# EAGLE design power_pre (EAGLE 6.5.0)
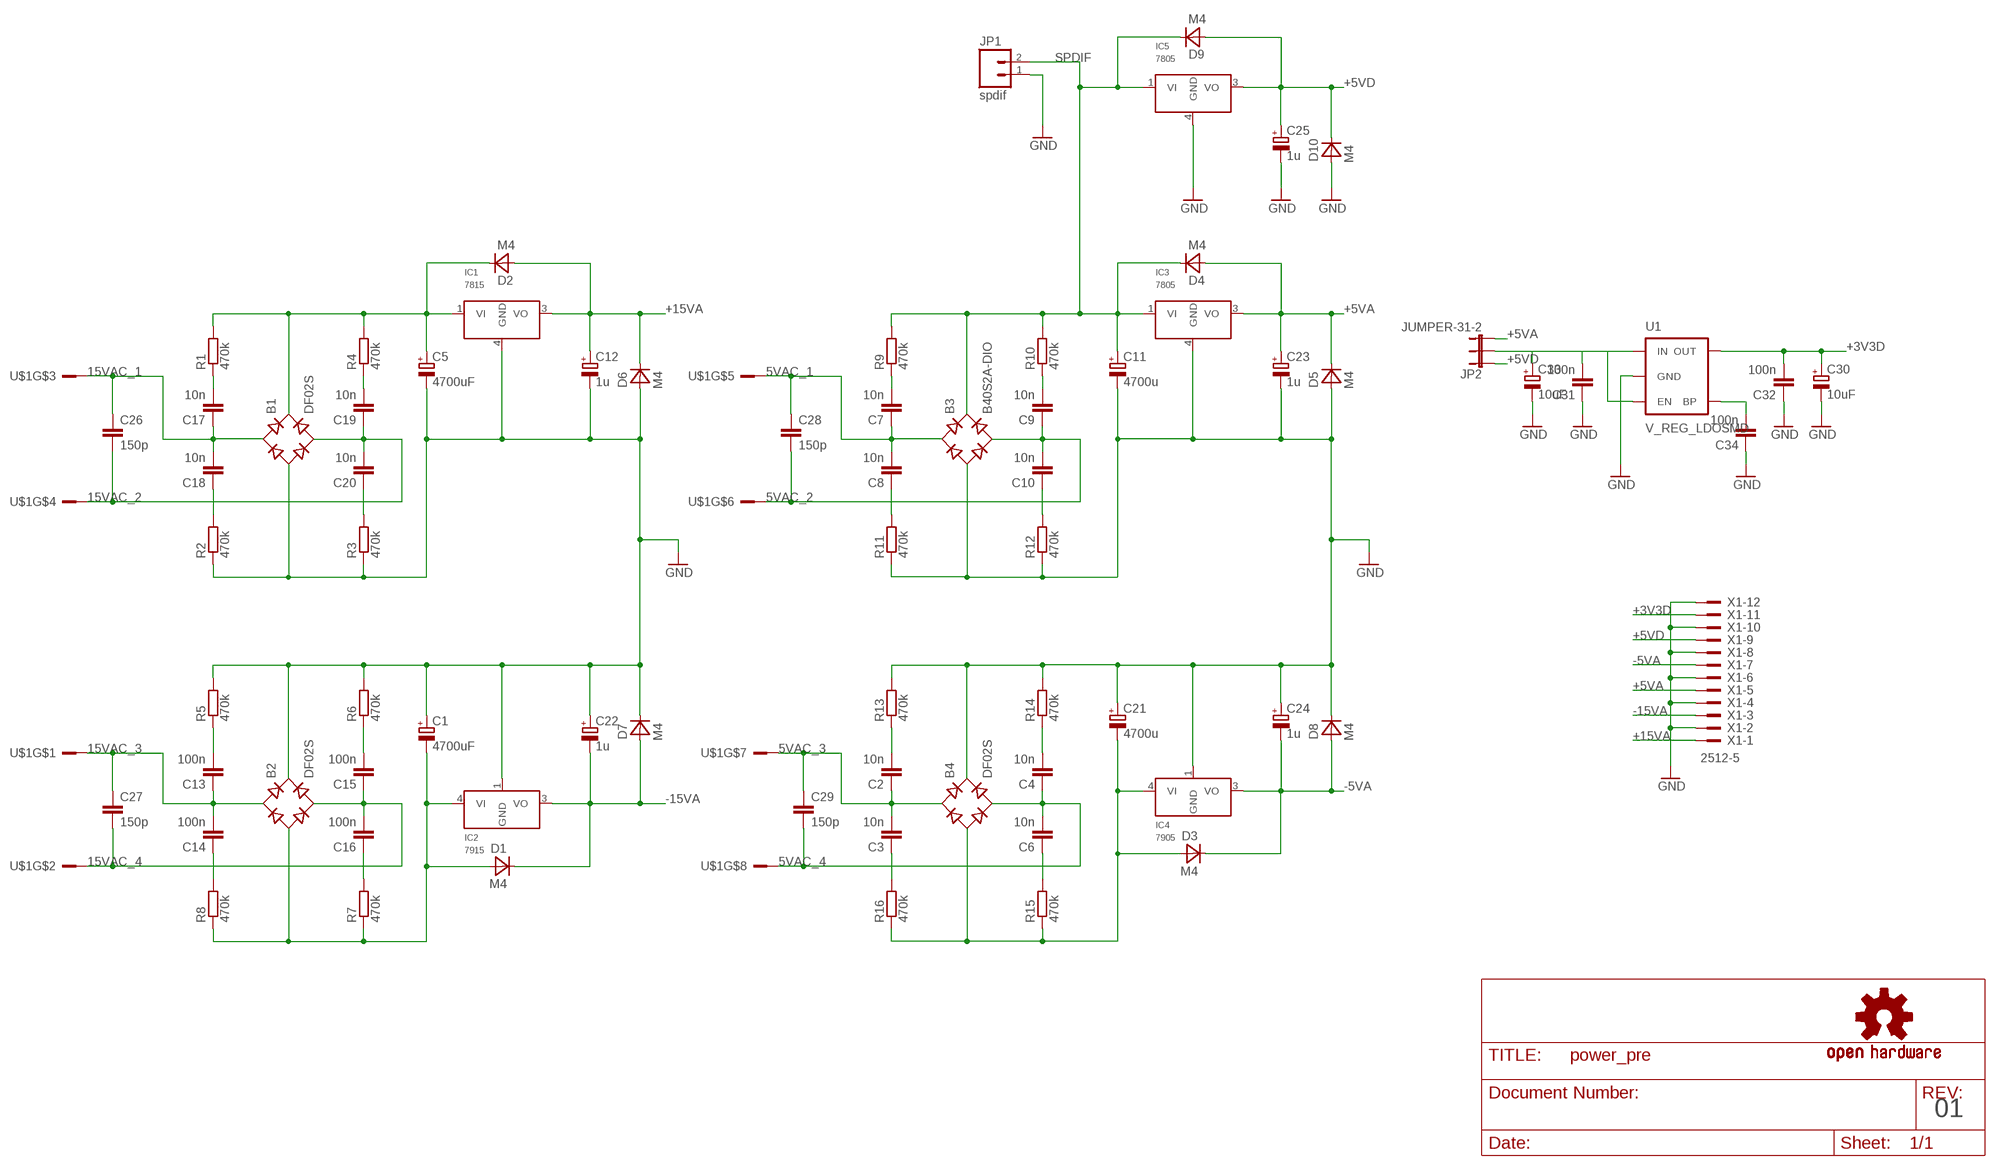
[diagram p0: schematic, sheet 1]

## Parts
B1  DF02S  [DFS]
B2  DF02S  [DFS]
B3  B40S2A-DIO  DF02S  [DFS]
B4  DF02S  [DFS]
C1  4700uF  CPOL-EUE7.5-18  [E7,5-18]
C2  10n  C-EUC0805  [C0805]
C3  10n  C-EUC0805  [C0805]
C4  10n  C-EUC0805  [C0805]
C5  4700uF  CPOL-EUE7.5-18  [E7,5-18]
C6  10n  C-EUC0805  [C0805]
C7  10n  C-EUC0805  [C0805]
C8  10n  C-EUC0805  [C0805]
C9  10n  C-EUC0805  [C0805]
C10  10n  C-EUC0805  [C0805]
C11  4700u  CPOL-EUE7.5-16  [E7,5-16]
C12  1u  CPOL-EUB  [PANASONIC_B]
C13  100n  C-EUC0805  [C0805]
C14  100n  C-EUC0805  [C0805]
C15  100n  C-EUC0805  [C0805]
C16  100n  C-EUC0805  [C0805]
C17  10n  C-EUC0805  [C0805]
C18  10n  C-EUC0805  [C0805]
C19  10n  C-EUC0805  [C0805]
C20  10n  C-EUC0805  [C0805]
C21  4700u  CPOL-EUE7.5-16  [E7,5-16]
C22  1u  CPOL-EUB  [PANASONIC_B]
C23  1u  CPOL-EUB  [PANASONIC_B]
C24  1u  CPOL-EUB  [PANASONIC_B]
C25  1u  CPOL-EUB  [PANASONIC_B]
C26  150p  C5/4.5  [C5B4.5]
C27  150p  C5/4.5  [C5B4.5]
C28  150p  C5/4.5  [C5B4.5]
C29  150p  C5/4.5  [C5B4.5]
C30  10uF  CPOL-EU153CLV-0405  [153CLV-0405]
C31  100n  C-EUC0805  [C0805]
C32  100n  C-EUC0805  [C0805]
C33  10uF  CPOL-EU153CLV-0405  [153CLV-0405]
C34  100n  C-EUC0805  [C0805]
D1  M4  MBRA340T3  [SMA]
D2  M4  MBRA340T3  [SMA]
D3  M4  MBRA340T3  [SMA]
D4  M4  MBRA340T3  [SMA]
D5  M4  MBRA340T3  [SMA]
D6  M4  MBRA340T3  [SMA]
D7  M4  MBRA340T3  [SMA]
D8  M4  MBRA340T3  [SMA]
D9  M4  MBRA340T3  [SMA]
D10  M4  MBRA340T3  [SMA]
IC1  7815  78XX  [D2PACK]
IC2  7915  79XX  [D2PACK]
IC3  7805  78XX  [D2PACK]
IC4  7905  79XX  [D2PACK]
IC5  7805  78XX  [D2PACK]
JP1  spdif  M02PTH  [1X02]
JP2  JUMPER-31-2  [SJ_3_PASTE1&2]
R1  470k  R-EU_R0805W  [R0805W]
R2  470k  R-EU_R0805W  [R0805W]
R3  470k  R-EU_R0805W  [R0805W]
R4  470k  R-EU_R0805W  [R0805W]
R5  470k  R-EU_R0805W  [R0805W]
R6  470k  R-EU_R0805W  [R0805W]
R7  470k  R-EU_R0805W  [R0805W]
R8  470k  R-EU_R0805W  [R0805W]
R9  470k  R-EU_R0805W  [R0805W]
R10  470k  R-EU_R0805W  [R0805W]
R11  470k  R-EU_R0805W  [R0805W]
R12  470k  R-EU_R0805W  [R0805W]
R13  470k  R-EU_R0805W  [R0805W]
R14  470k  R-EU_R0805W  [R0805W]
R15  470k  R-EU_R0805W  [R0805W]
R16  470k  R-EU_R0805W  [R0805W]
U1  V_REG_LDOSMD  [SOT23-5]
U$1  DEGSON_8  [DEGSON_8]
U$7  OSHW-LOGOM  [OSHW-LOGO-M]
X1  2512-5  [PAK100/2500-5-12]

## Nets
5VAC_1: B3.AC1 C7.1 C8.2 C28.1 U$1.5
5VAC_2: B3.AC2 C9.1 C10.2 C28.2 U$1.6
5VAC_3: B4.AC1 C2.1 C3.2 C29.1 U$1.7
5VAC_4: B4.AC2 C4.1 C6.2 C29.2 U$1.8
15VAC_1: B1.AC1 C17.1 C18.2 C26.1 U$1.3
15VAC_2: B1.AC2 C19.1 C20.2 C26.2 U$1.4
15VAC_3: B2.AC1 C13.1 C14.2 C27.1 U$1.1
15VAC_4: B2.AC2 C15.1 C16.2 C27.2 U$1.2
+3V3D: C30.+ C32.2 U1.5(OUT) X1.11
+5VA: C23.+ D4.A D5.C IC3.3(VO) JP2.3 X1.5
+5VD: C25.+ D9.A D10.C IC5.3(VO) JP2.1 X1.9
+15VA: C12.+ D2.A D6.C IC1.3(VO) X1.1
-5VA: C24.- D3.C D8.A IC4.3(VO) X1.7
-15VA: C22.- D1.C D7.A IC2.3(VO) X1.3
GND: B1.- B2.+ B3.- B4.+ C1.+ C5.- C11.- C12.- C21.+ C22.+ C23.- C24.+ C25.- C30.- C31.1 C32.1 C33.- C34.1 D5.A D6.A D7.C D8.C D10.A IC1.4(GND) IC2.1(GND) IC3.4(GND) IC4.1(GND) IC5.4(GND) JP1.1 R2.1 R3.1 R5.2 R6.2 R11.1 R12.1 R13.2 R14.2 U1.2(GND) X1.2 X1.4 X1.6 X1.8 X1.10 X1.12
N$1: C7.2 R9.1
N$2: C18.1 R2.2
N$4: C31.2 C33.+ JP2.2 U1.1(IN) U1.3(EN)
N$6: C13.2 R5.1
N$7: C34.2 U1.4(BP)
N$8: B1.+ C5.+ D2.C IC1.1(VI) R1.2 R4.2
N$9: C17.2 R1.1
N$10: B4.- C21.- D3.A IC4.4(VI) R15.1 R16.1
N$11: C19.2 R4.1
N$12: C20.1 R3.2
N$14: C6.1 R15.2
N$15: C8.1 R11.2
N$16: B2.- C1.- D1.A IC2.4(VI) R7.1 R8.1
N$17: C14.1 R8.2
N$18: C16.1 R7.2
N$19: C15.2 R6.1
N$20: C10.1 R12.2
N$21: C9.2 R10.1
N$23: C3.1 R16.2
N$24: C2.2 R13.1
N$25: C4.2 R14.1
SPDIF: B3.+ C11.+ D4.C D9.C IC3.1(VI) IC5.1(VI) JP1.2 R9.2 R10.2

## Notes on the sheet
- 01

## Library data of the parts
B1-B4 = rectifier:DF*S: Surface Mount Glass Passivated Bridge Rectifiers Source: Source: Comchip Bridge Rectifiers DF005S-G thru DF10S-G.pdf
C1 C5 C11 C12 C21-C25 C30 C33 = rcl:CPOL-EU: POLARIZED CAPACITOR, European symbol
C2-C4 C6-C10 C13-C20 C31 C32 C34 = rcl:C-EU: CAPACITOR, European symbol
C26-C29 = capacitor-wima:C: CAPACITOR naming: grid - package width
D1-D10 = diode:MBRA340T3: Surface Mount Schottky Power Rectifier Source: http://www.onsemi.com/pub_link/Collateral/MBRA340T3-D.PDF
IC1 IC3 IC5 = Simplex-ICs:78XX: 78xx positive voltage linear regulators
IC2 IC4 = Simplex-ICs:79XX: 79xx negative voltage linear regulators
JP1 = SparkFun-Connectors:M02: Standard 2-pin 0.1" header. Use with - straight break away headers ( PRT-00116) - right angle break away headers (PRT-00553) - swiss pins (PRT-00743) - machine pins (PRT-00117) - female headers (PRT-00115) Molex polarized connector foot print use with: PRT-08233 with associated crimp pins and housings. 2.54_SCREWTERM for use with PRT-10571. 3.5mm Screw Terminal footprints for PRT-08084 5mm Screw Terminal footprints for use with PRT-08433
JP2 = SparkFun-Passives:JUMPER-3
R1-R16 = rcl:R-EU_: RESISTOR, European symbol
U1 = SparkFun-PowerIC:V_REG_LDO: Voltage Regulator LDO Standard 150mA LDO voltage regulator in SOT-23 layout. Micrel part MIC5205. BP (by-pass) pin is used to lower output noise with 470pF cap.
U$1 = Simplex-Connectors:DEGSON_8: DG58C-B-08P-13 Degson Electronics 8 pole screw terminal 10mm grid
U$7 = SparkFun:OSHW-LOGO: Open Source Hardware Logo This logo indicates the piece of hardware it is found on incorporates a OSHW license and/or adheres to the definition of open source hardware found here: http://freedomdefined.org/OSHW
X1 = Simplex-Connectors:2512-: 3M (TM) Pak 100 4-Wall Header Source: 3M; MPN: N2514-5002RB; OC_FARNELL: 1788673; OC_NEWARK: 97K6709

## Net classes
1 vcc: width 0.203 mm

## Board
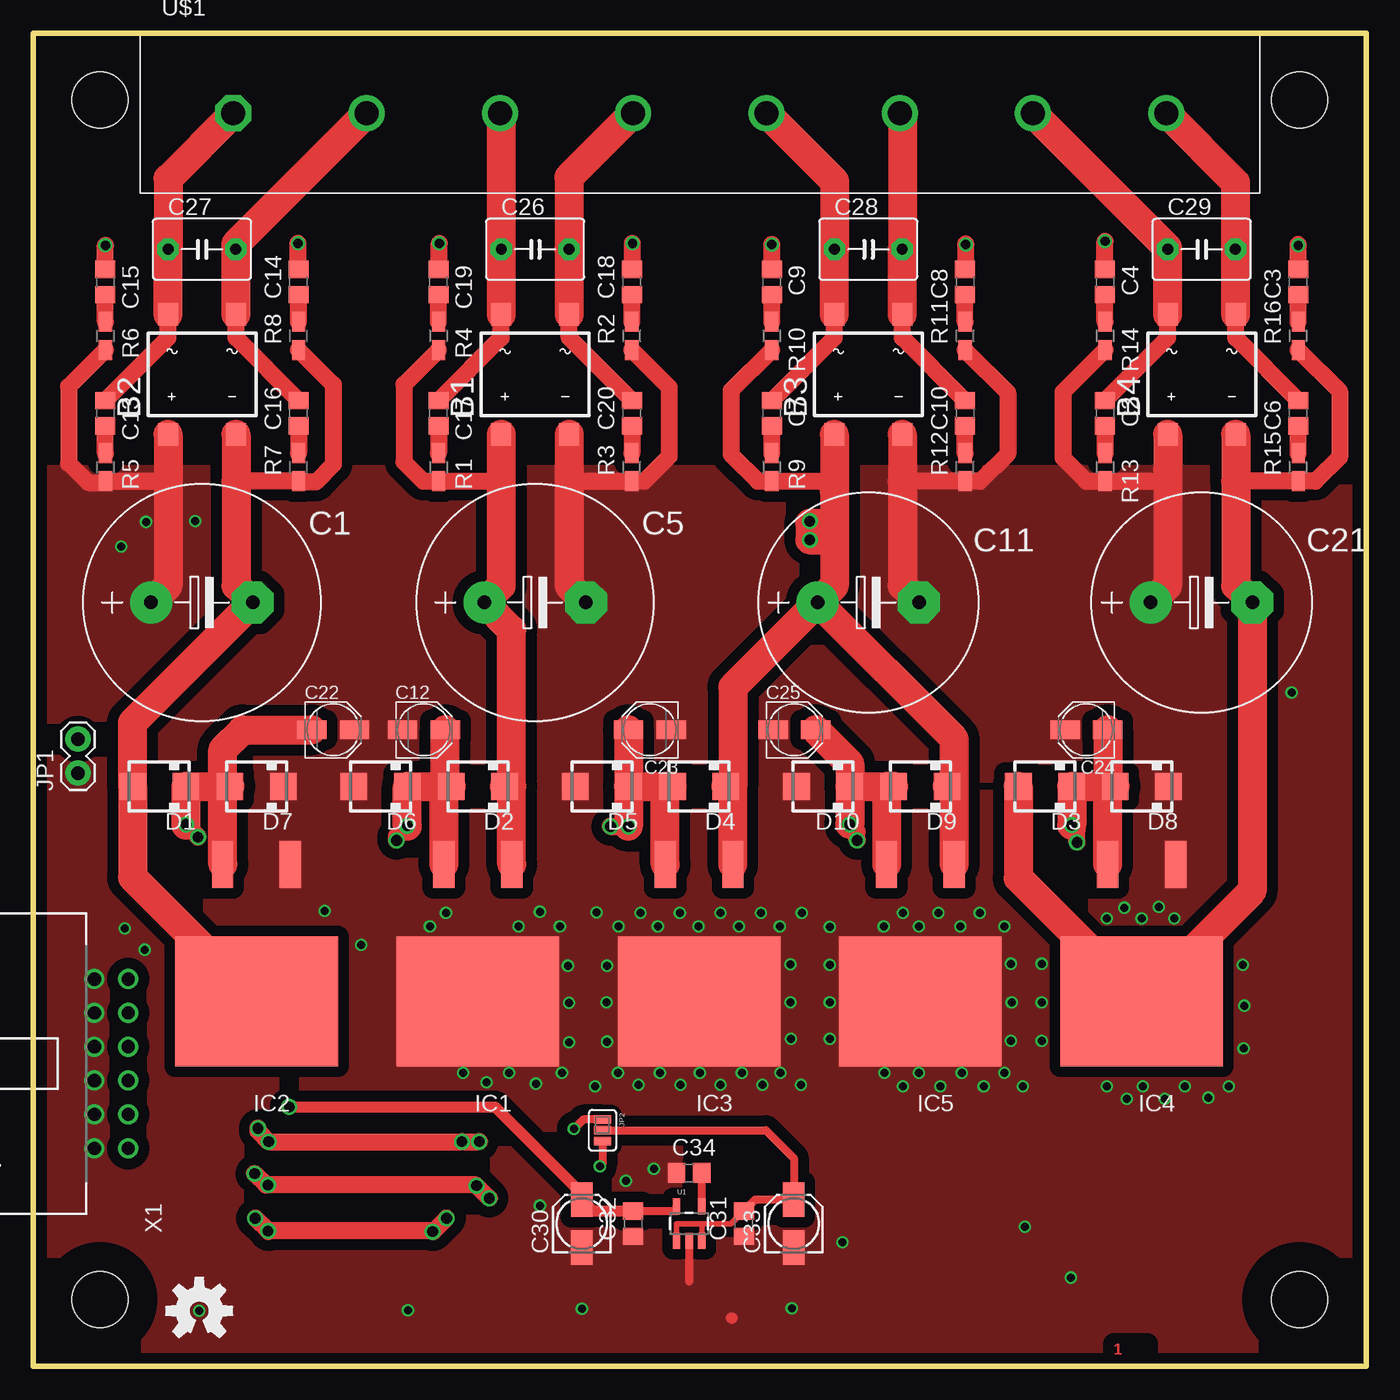
[diagram p1: board, top side]
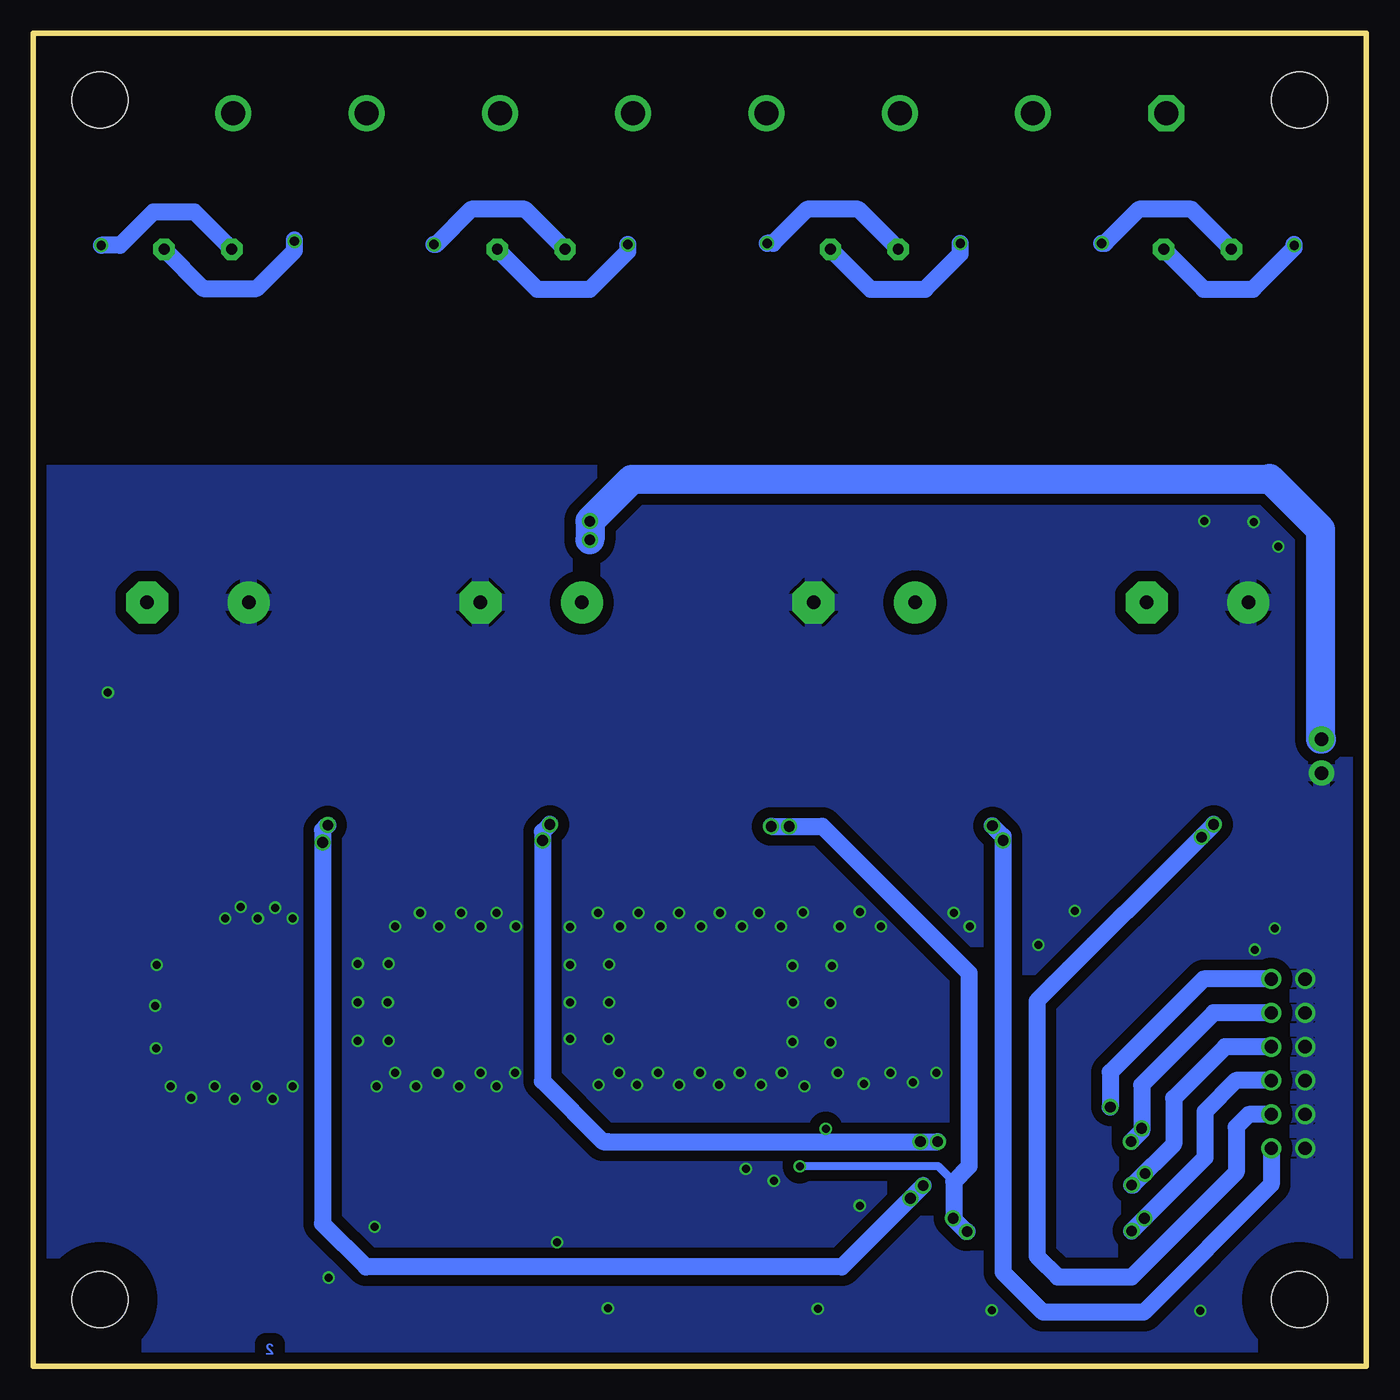
[diagram p2: board, bottom side, seen from below]

Size 100 x 100 mm. Coordinates in mm from the lower left corner, seen from the top.
Outline: 0,0 100,0 100,100 0,100 0,0
Copper layers (1*2*15*16): Top 0.035mm / dielectric 0.2mm / Route2 0.0175mm / dielectric 1.1mm / Route15 0.0175mm / dielectric 0.2mm / Bottom 0.035mm
Design rules "SeeedStudio_DRU_no_angle_20130527": minimum track width 6mil, minimum drill 12mil, track to track 6mil, track to pad 6mil, pad to pad 6mil, via to via 6mil, smd to smd 0mil, copper to edge 10mil, drill to drill 10mil, minimum pad ring 6mil, minimum via ring 6mil, stop-mask expansion 2mil, vias tented up to drill 25mil, thermal gap 10mil
Holes 4.2 mm at 5,95 95,5 5,5 95,95
tRestrict: area 91.7,1.7 to 98.3,8.3; area 91.7,91.7 to 98.3,98.3; area 1.7,1.7 to 8.3,8.3; area 1.7,91.7 to 8.3,98.3
bRestrict: area 1.7,91.7 to 8.3,98.3; area 91.7,91.7 to 98.3,98.3; area 91.7,1.7 to 98.3,8.3; area 1.7,1.7 to 8.3,8.3

### Footprints (pad centres in the part's own frame; a part is rotated, then mirrored left to right if it is on the bottom)
DFS = smd 1.5 x 1.7: + -2.55,-4.5; - 2.55,-4.5; AC1 -2.55,4.5; AC2 2.55,4.5
E7,5-18 = drill 1.016 pad 3.15: + -3.81,0 | drill 1.016 pad 3.15 octagon: - 3.81,0
C0805 = smd 1.3 x 1.5: 1 -0.95,0; 2 0.95,0
E7,5-16 = drill 1.016 pad 3.15: + -3.81,0 | drill 1.016 pad 3.15 octagon: - 3.81,0
PANASONIC_B = smd 2.2 x 1.4: + 1.6,0; - -1.6,0
C5B4.5 = drill 0.813 pad 1.6 octagon: 1 -2.54,0; 2 2.54,0
153CLV-0405 = smd 2.6 x 1.6: + 1.8,0; - -1.8,0
SMA = smd 2 x 2: A 2,0; C -2,0
D2PACK = smd 1.6 x 3.5: 1 -2.54,1.75; 3 2.54,1.75 | smd 12.2 x 9.75: 4 0,12.025
1X02 = drill 1.016 pad 1.88: 1 0,0; 2 2.54,0
SJ_3_PASTE1&2 = smd 0.635 x 1.27: 1 -0.813,0; 2 0,0; 3 0.813,0
R0805W = smd 1.5 x 1: 1 -1.052,0; 2 1.052,0
SOT23-5 = smd 0.55 x 1.2: 1 -0.95,-1.3; 2 0,-1.3; 3 0.95,-1.3; 4 0.95,1.3; 5 -0.95,1.3
DEGSON_8 = drill 1.8 octagon: 1 -35,0 | drill 1.8: 2 -25,0; 3 -15,0; 4 -5,0; 5 5,0; 6 15,0; 7 25,0; 8 35,0
PAK100/2500-5-12 = drill 1 pad 1.422: 1 -6.35,-1.27; 2 -6.35,1.27; 3 -3.81,-1.27; 4 -3.81,1.27; 5 -1.27,-1.27; 6 -1.27,1.27; 7 1.27,-1.27; 8 1.27,1.27; 9 3.81,-1.27; 10 3.81,1.27; 11 6.35,-1.27; 12 6.35,1.27

### Placement (x,y rotation side)
B1  37.65,74.4 0 top
B2  12.65,74.4 0 top
B3  62.65,74.4 0 top
B4  87.65,74.4 0 top
C1  12.65,57.3 0 top
C2  80.4,71.5 270 top
C3  94.9,81.35 90 top
C4  80.4,81.35 270 top
C5  37.65,57.3 0 top
C6  94.9,71.5 90 top
C7  55.4,71.5 270 top
C8  69.9,81.35 90 top
C9  55.4,81.35 270 top
C10  69.9,71.5 90 top
C11  62.65,57.3 0 top
C12  29.3,47.75 0 top
C13  5.4,71.5 270 top
C14  19.9,81.35 90 top
C15  5.4,81.35 270 top
C16  19.9,71.5 90 top
C17  30.4,71.5 270 top
C18  44.9,81.35 90 top
C19  30.4,81.35 270 top
C20  44.9,71.5 90 top
C21  87.65,57.3 0 top
C22  22.5,47.75 0 top
C23  46.25,47.75 180 top
C24  79,47.75 180 top
C25  57.1,47.75 0 top
C26  37.65,83.8 0 top
C27  12.65,83.8 0 top
C28  62.65,83.8 0 top
C29  87.65,83.8 0 top
C30  41.15,10.7 90 top
C31  53.3,10.7 90 top
C32  45,10.7 90 top
C33  57.05,10.7 90 top
C34  49.2,14.5 0 top
D1  9.45,43.5 180 top
D2  33.35,43.5 180 top
D3  75.9,43.5 180 top
D4  49.95,43.5 180 top
D5  42.65,43.5 180 top
D6  26.05,43.5 180 top
D7  16.75,43.5 180 top
D8  83.15,43.5 180 top
D9  66.55,43.5 180 top
D10  59.25,43.5 180 top
IC1  33.35,39.4 180 top
IC2  16.75,39.4 180 top
IC3  49.95,39.4 180 top
IC4  83.15,39.4 180 top
IC5  66.55,39.4 180 top
JP1  3.35,44.5 90 top
JP2  42.7,17.7 270 top
R1  30.4,67.45 270 top
R2  44.9,77.3 90 top
R3  44.9,67.45 90 top
R4  30.4,77.3 270 top
R5  5.4,67.45 270 top
R6  5.4,77.3 270 top
R7  19.9,67.45 90 top
R8  19.9,77.3 90 top
R9  55.4,67.45 270 top
R10  55.4,77.3 270 top
R11  69.9,77.3 90 top
R12  69.9,67.45 90 top
R13  80.4,67.45 270 top
R14  80.4,77.3 270 top
R15  94.9,67.45 90 top
R16  94.9,77.3 90 top
U1  49.2,10.7 0 top
U$1  50,94 0 top
U$7  12.45,4.15 0 top
X1  5.85,22.7 90 top

### Tracks (layer width: path | path; a pad name or v marks a point on that pad's centre or on a via)
5VAC_1  (via drill 0.7)
  Top 1.27: C7.1 60.1,77.15 B3.AC1 | C8.2 69.95,82.35 v69.95,84.15 69.95,84.2
  Top 2.184: B3.AC1 C28.1 60.11,88.89 U$1.5
  Bottom 1.27: C28.1 63.11,86.8 67.15,86.8 69.8,84.15 v69.95,84.15
5VAC_2  (via drill 0.7)
  Top 1.27: C10.2 65.2,77.15 B3.AC2 | C9.1 v55.4,84.15
  Top 2.184: B3.AC2 C28.2 65.19,93.81 U$1.6
  Bottom 1.27: C28.2 62.19,80.8 58.25,80.8 55.4,83.65 v55.4,84.15
5VAC_3  (via drill 0.7)
  Top 1.27: C2.1 85.1,77.15 B4.AC1 | C3.2 v94.9,84.1 94.9,84.15
  Top 2.184: B4.AC1 C29.1 85.11,83.89 U$1.7
  Bottom 1.27: C29.1 87.91,86.6 91,86.6 93.5,84.1 v94.9,84.1
5VAC_4  (via drill 0.7)
  Top 1.27: C6.2 90.2,77.15 B4.AC2 | C4.1 v80.4,84.4
  Top 2.184: B4.AC2 C29.2 90.19,88.81 U$1.8
  Bottom 1.27: C29.2 87.24,80.85 83.25,80.85 80.4,83.7 v80.4,84.4 80.4,84.5
15VAC_1  (via drill 0.7)
  Top 1.27: C17.1 35.1,77.15 35.1,79.4 | C18.2 44.95,82.35 v44.95,84.25
  Top 2.184: B1.AC1 35.1,79.4 C26.1 35.11,93.89 U$1.3
  Bottom 1.27: C26.1 38.11,86.8 41.95,86.8 44.5,84.25 v44.95,84.25
15VAC_2  (via drill 0.7)
  Top 1.27: C20.2 40.2,77.15 B1.AC2 | C19.1 30.45,82.35 v30.45,84.25
  Top 2.184: B1.AC2 C26.2 40.19,89.19 U$1.4
  Bottom 1.27: C26.2 37.19,80.8 33.1,80.8 30.45,83.45 v30.45,84.25
15VAC_3  (via drill 0.7)
  Top 1.27: C13.1 10.1,77.15 B2.AC1 | C14.2 19.85,82.35 v19.85,84.25
  Top 2.184: B2.AC1 10.1,83.3 C27.1 | C27.1 | U$1.1 10.1,89.1 C27.1
  Bottom 1.27: C27.1 13.11,86.8 17.05,86.8 19.6,84.25 v19.85,84.25
15VAC_4  (via drill 0.7)
  Top 1.27: C16.2 15.2,77.15 B2.AC2 | C15.1 v5.4,84.1
  Top 2.184: B2.AC2 C27.2 15.19,84.19 U$1.2
  Bottom 1.27: C27.2 12.19,80.8 8.5,80.8 5.4,83.9 v5.4,84.1 5.4,84.15
+3V3D  (via drill 0.8)
  Top 0.61: C32.2 48.25,11.65 U1.5
  Top 0.813: v19.2,19.45 34.65,19.45 41.15,12.95 C30.+ 42,11.65 C32.2
  Bottom 1.27: X1.11 12.2,29.05 19.2,22.05 v19.2,19.45
+5VA  (via drill 0.6, 0.8)
  Top 0.61: JP2.3 42.7,15.2 v42.5,15
  Top 1.27: 17.65,10.1 v17.6,10.15 | v16.65,11.1 v17.6,10.15 | v29.95,10.1 30,10.1 v31,11.1 30.05,10.15 v17.6,10.15 | v43.3,40.5 v44.65,40.5
  Top 2.184: D5.C D4.A 47.41,43.5 IC3.3 | D5.C v44.65,40.5 | C23.+ D5.C
  Bottom 0.61: v42.5,15 32.1,15 30.95,13.85
  Bottom 1.27: X1.5 9.77,21.43 12.1,19.1 12.1,15.65 v17.6,10.15 | v44.65,40.5 40.8,40.5 29.8,29.5 29.8,15 30.95,13.85 30.95,11.15 v31,11.1 30,10.1 v29.95,10.1
+5VD  (via drill 0.6, 0.8)
  Top 0.61: JP2.1 41.26,18.51 v40.55,17.8
  Top 1.27: v16.85,17.85 16.85,17.65 v17.65,16.85 v32.15,16.85 v33.45,16.85 | v61.8,39.45 61.8,40.1 v61.25,40.65
  Top 2.184: C25.+ 61.25,45.2 D10.C | D10.C v61.25,40.65 | D10.C 64.01,43.5 | 64.01,43.5 IC5.3 | 64.01,43.5 D9.A
  Bottom 0.61: 57.05,16.85 56.9,16.85 | v40.55,17.8 40.55,17.05 40.75,16.85
  Bottom 1.27: X1.9 11.44,26.51 16.85,21.1 16.85,17.65 v17.65,16.85 | v32.15,16.85 40.75,16.85 56.9,16.85 57.25,16.85 61.8,21.4 61.8,40.1 v61.25,40.65
+15VA  (via drill 0.8)
  Top 1.27: v27.25,39.45 27.25,39.75 v28.05,40.55
  Top 2.184: IC1.3 30.81,43.5 D2.A | D2.A 30.9,43.95 C12.+ | 28.05,40.5 v28.05,40.55 D6.C D2.A
  Bottom 1.27: X1.1 7.12,13.63 16.7,4.05 24.25,4.05 27.25,7.05 27.25,39.75 v28.05,40.55
-5VA  (via drill 0.8)
  Top 1.27: v16.6,14.45 17.45,13.6 v17.6,13.6 33.2,13.6 v33.25,13.55 v34.2,12.6 | v78.3,39.3 78.3,40.2 v77.9,40.6
  Top 2.184: IC4.3 80.61,43.5 | v77.9,40.6 D3.C 80.61,43.5 | 80.61,43.5 D8.A | 80.61,43.5 C24.-
  Bottom 1.27: X1.7 10.58,23.97 14.45,20.1 14.45,16.65 17.5,13.6 v17.6,13.6 | v77.9,40.6 78.3,40.2 78.3,10.7 75.05,7.45 39.35,7.45 v33.25,13.55
-15VA  (via drill 0.8)
  Top 1.27: v12.35,39.7 12.35,39.75 v11.45,40.65
  Top 2.184: IC2.3 14.21,43.5 | 11.45,40.6 v11.45,40.65 D1.C 13.65,43.5 14.21,43.5 | 14.21,43.5 14.21,46.26 15.7,47.75 C22.- | D7.A 14.21,43.5
  Bottom 1.27: X1.3 8.81,18.89 9.75,17.95 9.75,14.55 17.6,6.7 23.15,6.7 24.7,8.25 24.7,27.4 v11.45,40.65
GND  (via drill 0.6)
  Top 0.61: U1.2 49.2,6.35
  Top 0.813: 52.35,3.6 52.45,3.6
  Top 1.27: B1.- 40.2,66.4 R3.1 45.85,66.4 47.7,68.25 47.7,73.45 R2.1 | R6.2 2.65,73.5 2.65,67.75 4.1,66.3 5.3,66.3 R5.2 9.85,66.4 10.1,66.65 | 65.2,66.35 65.2,66.4 R12.1 71.05,66.4 73.1,68.45 73.1,73.05 R11.1 | 85.1,67.3 85.1,66.4 R13.2 79,66.4 77.25,68.15 77.25,73.1 R14.2
  Top 2.184: B1.- 40.2,58.56 C5.- | B2.+ 10.1,66.65 10.1,58.56 C1.+ | B3.- 65.2,66.35 65.2,58.56 C11.- | B4.+ 85.1,67.3 85.1,58.56 C21.+
  other vias: 43.9,33 56,33 49.9,33 46.85,33 52.95,33 50,22 47,22 43.85,22 53.15,22 56.05,22 39.5,33 36.4,33 29.75,33 32.25,22 35.7,22 39.65,22 72.85,33 66.45,33 63.8,33 69.55,33 66.45,22 69.65,22 72.85,22 63.85,22 80.55,21 83.25,21 89.7,21 86.4,21 83.15,33.6 80.55,33.6 85.6,33.6 38,12.05 28.1,4.2 12.45,4.15 74.4,10.45 77.85,6.65 56.9,4.35 41.15,4.3 60.7,9.3 94.4,50.55 45.55,34 57.65,34 51.55,34 48.5,34 54.6,34 42.25,34.05 51.55,21.1 48.55,21.1 45.4,21.1 54.7,21.1 57.6,21.1 42.15,21 67.9,34 65.25,34 71,34 68.05,21 71.3,21 74.25,21 65.25,21 21.85,34.15 24.6,31.6 6.85,32.85 8.35,31.25 82.05,20.05 84.9,20.05 88.15,20.15 81.85,34.4 84.45,34.45 40.1,30.05 56.8,27.3 56.85,24.55 40.2,27.25 59.75,30.1 59.75,24.55 40.2,24.3 56.8,30.15 59.75,27.3 73.4,27.3 73.35,30.2 73.35,24.4 59.75,32.95 90.75,30.1 90.85,27.05 90.8,23.85 6.6,61.5 30.95,34 38,34.1 34,21.3 37.7,21.2 43.05,30.05 43,27.3 43.05,24.35 75.65,30.2 75.65,27.3 75.65,24.4 8.45,63.35 12.15,63.4 44.45,13.9 46.55,14.8
  pour Top (isolate 0.813, no thermals): 0,67 100,67 100,0 0,0
  pour Bottom (isolate 0.813): 0,0 100,0 100,67 0,67
N$1
  Top 1.27: R9.1 C7.2
N$2
  Top 1.27: R2.2 C18.1
N$4
  Top 0.406: C31.2 52.35,10.7 50.25,10.7 50.15,10.7 | 50.15,10.7 48.25,10.7 U1.1 | U1.3 50.15,10.7
  Top 0.61: JP2.2 54.95,17.7 57.05,15.6 C33.+ 54.15,12.5 C31.2
N$6
  Top 1.27: R5.1 C13.2
N$7
  Top 0.61: U1.4 C34.2
N$8
  Top 1.27: B1.+ 35.1,66.4 R1.2 29.25,66.4 27.8,67.85 27.8,73.65 R4.2
  Top 2.184: B1.+ 35.1,58.56 C5.+ 35.89,55.25 35.89,43.5 | 35.89,43.5 D2.C | IC1.1 35.89,43.5
N$9
  Top 1.27: C17.2 R1.1
N$10
  Top 1.27: 90.2,66.4 R15.1 96.2,66.4 98,68.2 98,73.15 R16.1
  Top 2.184: B4.- 90.2,66.4 90.2,58.56 C21.- 91.45,35.67 IC4.4 73.9,36.62 D3.A
N$11
  Top 1.27: R4.1 C19.2
N$12
  Top 1.27: C20.1 R3.2
N$14
  Top 1.27: R15.2 C6.1
N$15
  Top 1.27: R11.2 C8.1
N$16
  Top 1.27: R8.1 22.5,73.65 22.5,67.65 21.2,66.35 19.95,66.35 R7.1 15.2,66.4
  Top 2.184: B2.- 15.2,66.4 15.2,58.56 C1.- 7.45,48.29 D1.A 7.45,36.67 IC2.4
N$17
  Top 1.27: R8.2 C14.1
N$18
  Top 1.27: C16.1 R7.2
N$19
  Top 1.27: R6.1 C15.2
N$20
  Top 1.27: R12.2 C10.1
N$21
  Top 1.27: R10.1 C9.2
N$23
  Top 1.27: R16.2 C3.1
N$24
  Top 1.27: C2.2 R13.1
N$25
  Top 1.27: R14.1 C4.2
SPDIF  (via drill 0.8)
  Top 1.27: 60.1,65.65 60.1,66.4 R9.2 54.35,66.4 52.35,68.4 52.35,73.2 R10.2
  Top 2.184: B3.+ 60.1,65.65 60.1,63.25 | 60.1,63.25 60.1,58.56 C11.+ | IC3.1 52.49,43.5 | 52.49,43.5 D4.C | C11.+ 52.49,50.95 52.49,43.5 | IC5.1 69.09,43.7 | 69.09,43.7 69.09,47.05 C11.+ | D9.C 68.89,43.5 69.09,43.7 | 60.1,63.25 58.25,63.25 v58.25,62 59.95,62
  Bottom 2.184: v58.25,62 v58.25,63.4 55.1,66.55 7.25,66.55 7.25,66.6 3.44,62.79 3.44,47.04 JP1.2

### Text on the board
Top: 1
Bottom: 2
tmine: power circuit for mixer board rev 1.1 / github.com/rodan/ampy / author: petre rodan / date: apr 2014